# Altium schematic sheet KursSCH3.schdoc
size 420 x 297 mm; DocumentNumber: СПбПУ 12.03.2019 + Э3; SheetNumber: 3; SheetTotal: 4; Format: A3
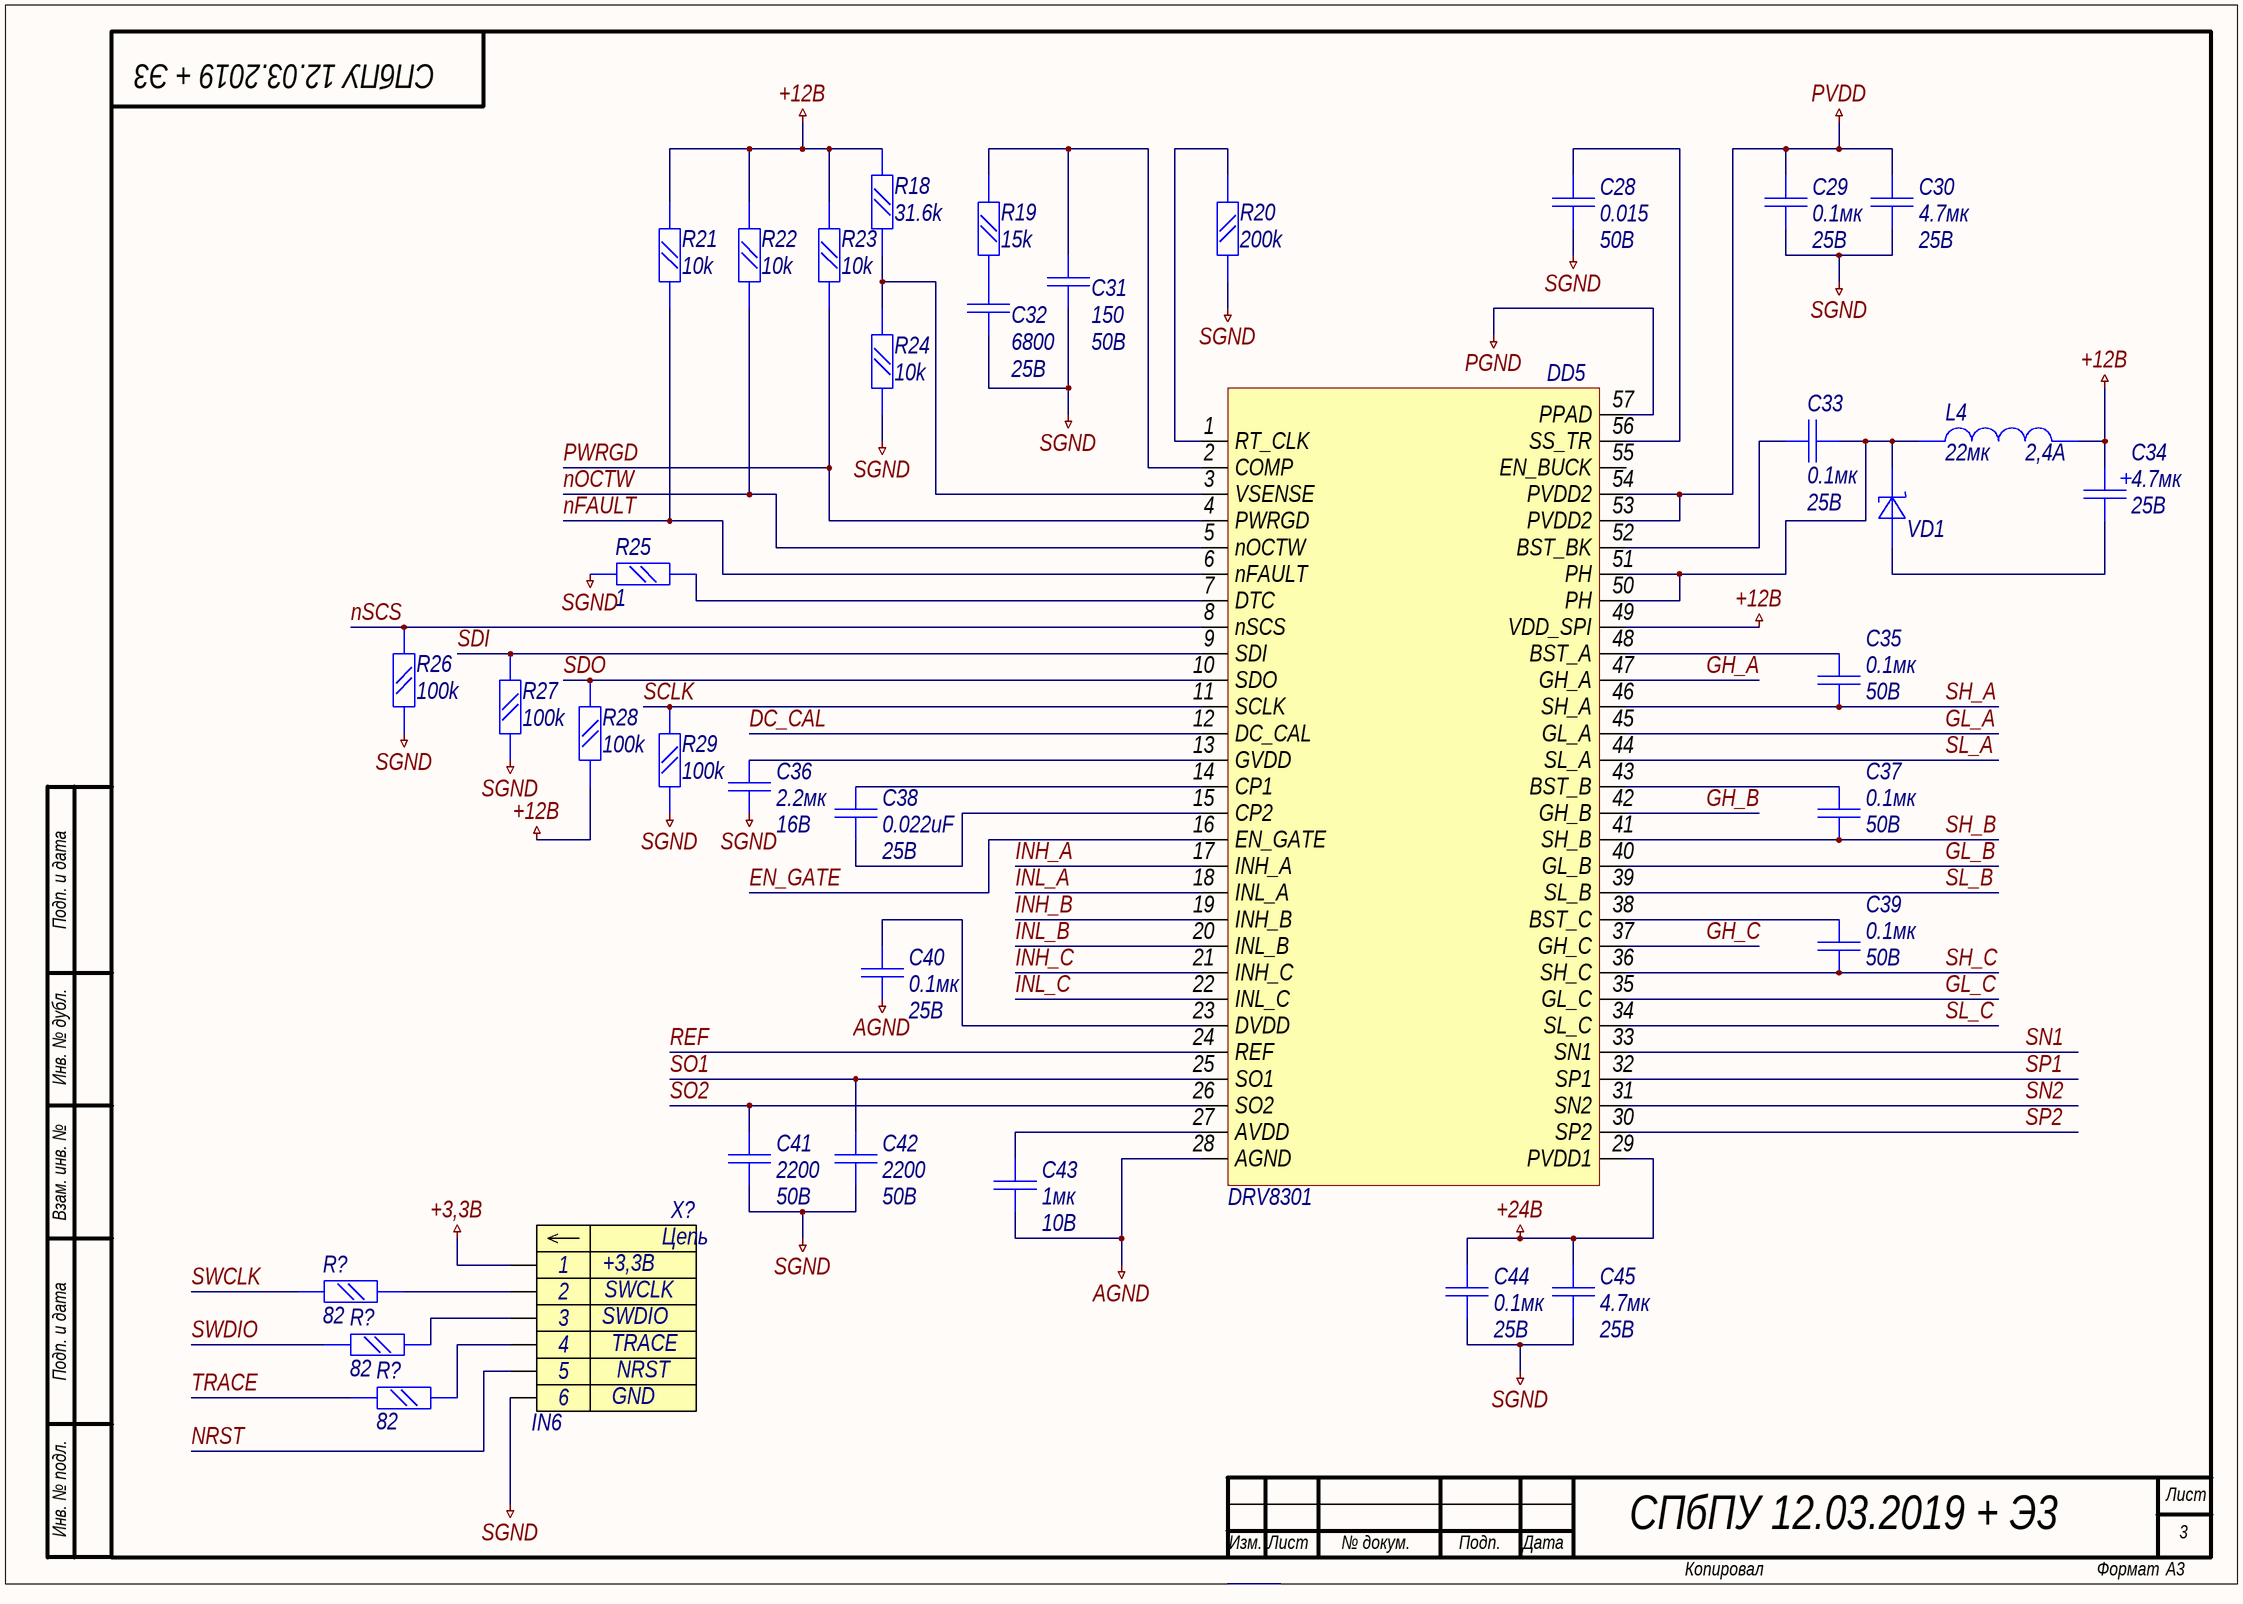
[diagram p0: KursSCH3.schdoc]

## Parts
(Parts that share a designator on the sheet are numbered #1, #2 ... from top to bottom, then left to right.)
C28  value 0.015  Voltage: 50В  [C0402]  (hidden comment: Capacitor)
C29  value 0.1мк  Voltage: 25В  [C0603]  (hidden comment: Capacitor)
C30  value 4.7мк  Voltage: 25В  [C0805]  (hidden comment: Capacitor)
C31  value 150  Voltage: 50В  [C0402]  (hidden comment: Capacitor)
C32  value 6800  Voltage: 25В  [C0402]  (hidden comment: Capacitor)
C33  value 0.1мк  Voltage: 25В  [C0603]  (hidden comment: Capacitor)
C34  value 4.7мк  Voltage: 25В  [C3528-p]  (hidden comment: Capacitor-T)
C35  value 0.1мк  Voltage: 50В  [C0805]  (hidden comment: Capacitor)
C36  value 2.2мк  Voltage: 16В  [C0603]  (hidden comment: Capacitor)
C37  value 0.1мк  Voltage: 50В  [C0805]  (hidden comment: Capacitor)
C38  value 0.022uF  Voltage: 25В  [C0603]  (hidden comment: Capacitor)
C39  value 0.1мк  Voltage: 50В  [C0805]  (hidden comment: Capacitor)
C40  value 0.1мк  Voltage: 25В  [C0603]  (hidden comment: Capacitor)
C41  value 2200  Voltage: 50В  [C0402]  (hidden comment: Capacitor)
C42  value 2200  Voltage: 50В  [C0402]  (hidden comment: Capacitor)
C43  value 1мк  Voltage: 10В  [C0603]  (hidden comment: Capacitor)
C44  value 0.1мк  Voltage: 25В  [C0603]  (hidden comment: Capacitor)
C45  value 4.7мк  Voltage: 25В  [C0805]  (hidden comment: Capacitor)
DD5  DRV8301
L4  I: 2,4А  L: 22мк  [747779115]  (hidden comment: 7447779115)
R18  value 31.6k  [R0603]  (hidden comment: Resistor_0,125W)
R19  value 15k  [R0603]  (hidden comment: Resistor_0,125W)
R20  value 200k  [R0603]  (hidden comment: Resistor_0,125W)
R21  value 10k  [R0402]  (hidden comment: Resistor_0,125W)
R22  value 10k  [R0402]  (hidden comment: Resistor_0,125W)
R23  value 10k  [R0402]  (hidden comment: Resistor_0,125W)
R24  value 10k  [R0402]  (hidden comment: Resistor_0,125W)
R25  value 1  [R0603]  (hidden comment: Resistor_0,125W)
R26  value 100k  [R0805]  (hidden comment: Resistor_0,125W)
R27  value 100k  [R0805]  (hidden comment: Resistor_0,125W)
R28  value 100k  [R0805]  (hidden comment: Resistor_0,125W)
R29  value 100k  [R0805]  (hidden comment: Resistor_0,125W)
R?#1  value 82  [R0603]  (hidden comment: Resistor_0,125W)
R?#2  value 82  [R0603]  (hidden comment: Resistor_0,125W)
R?#3  value 82  [R0603]  (hidden comment: Resistor_0,125W)
VD1  Schottky  [SOD-123]  (value not drawn)
X?  IN6  U: +3,3В  2: SWCLK  1: SWDIO  4: TRACE  3: NRST  [USB-B]

## Nets
+3,3В: X?.1
+12В: C34.1 DD5.49(VDD_SPI) L4.2 R18.2 R21.2 R22.2 R23.2 R28.1
+24В: C44.2 C45.2 DD5.29(PVDD1)
AGND: C40.1 C43.1 DD5.28(AGND)
PGND: DD5.57(PPAD)
PVDD: C29.2 C30.2 DD5.53(PVDD2) DD5.54(PVDD2)
SGND: C28.1 C29.1 C30.1 C31.1 C32.1 C36.1 C41.1 C42.1 C44.1 C45.1 R20.1 R24.1 R25.1 R26.1 R27.1 R29.1 X?.4(6)
DC_CAL: DD5.12(DC_CAL)
EN_GATE: DD5.16(EN_GATE)
GH_A: DD5.47(GH_A)
GH_B: DD5.42(GH_B)
GH_C: DD5.37(GH_C)
GL_A: DD5.45(GL_A)
GL_B: DD5.40(GL_B)
GL_C: DD5.35(GL_C)
INH_A: DD5.17(INH_A)
INH_B: DD5.19(INH_B)
INH_C: DD5.21(INH_C)
INL_A: DD5.18(INL_A)
INL_B: DD5.20(INL_B)
INL_C: DD5.22(INL_C)
nFAULT: DD5.6(nFAULT) R21.1
nOCTW: DD5.5(nOCTW) R22.1
NRST: X?.4(5)
nSCS: DD5.8(nSCS) R26.2
PWRGD: DD5.4(PWRGD) R23.1
REF: DD5.24(REF)
SCLK: DD5.11(SCLK) R29.2
SDI: DD5.9(SDI) R27.2
SDO: DD5.10(SDO) R28.2
SH_A: C35.1 DD5.46(SH_A)
SH_B: C37.1 DD5.41(SH_B)
SH_C: C39.1 DD5.36(SH_C)
SL_A: DD5.44(SL_A)
SL_B: DD5.39(SL_B)
SL_C: DD5.34(SL_C)
SN1: DD5.33(SN1)
SN2: DD5.31(SN2)
SO1: C42.2 DD5.25(SO1)
SO2: C41.2 DD5.26(SO2)
SP1: DD5.32(SP1)
SP2: DD5.30(SP2)
SWCLK: R?#1.1
SWDIO: R?#2.1
TRACE: R?#3.1
NetC28_2: C28.2 DD5.56(SS_TR)
NetC31_2: C31.2 DD5.2(COMP) R19.2
NetC32_2: C32.2 R19.1
NetC33_1: C33.1 DD5.50(PH) DD5.51(PH) L4.1 VD1.2(К)
NetC33_2: C33.2 DD5.52(BST_BK)
NetC34_2: C34.2 VD1.1(А)
NetC35_2: C35.2 DD5.48(BST_A)
NetC36_2: C36.2 DD5.13(GVDD)
NetC37_2: C37.2 DD5.43(BST_B)
NetC38_1: C38.1 DD5.15(CP2)
NetC38_2: C38.2 DD5.14(CP1)
NetC39_2: C39.2 DD5.38(BST_C)
NetC40_2: C40.2 DD5.23(DVDD)
NetC43_2: C43.2 DD5.27(AVDD)
NetDD5_1: DD5.1(RT_CLK) R20.2
NetDD5_3: DD5.3(VSENSE) R18.1 R24.2
NetDD5_7: DD5.7(DTC) R25.2
NetR?#1_2: R?#1.2 X?.2
NetR?#2_2: R?#2.2 X?.3
NetR?#3_2: R?#3.2 X?.4

Not connected (* = marked no-connect by the designer): DD5 55(EN_BUCK)

## Notes on the sheet
- Подп. и дата
- Инв. № дубл.
- Взам. инв. №
- Инв. № подл.
- Лист
- Изм.
- № докум.
- Подп.
- Дата
- Копировал
- Формат
- (in symbol USB-B_1) Цепь

## Library data of the parts
C28 = GRM155R71H153KA12D: Manufacturer: Murata; Type: Конденсатор; ID: 176; Tolerance: ±10%; Dielectric Type: X7R; Application Category: 1; Working Temperature Min: -55°С; Working Temperature Max: +125°С; Part Number: GRM155R71H153KA12D; Footprint: 0402
C29 C33 C40 C44 = GRM188R71E104KA01D: Manufacturer: Murata; Type: Конденсатор; ID: 228; Tolerance: ±10%; Dielectric Type: X7R; Application Category: 1; Working Temperature Min: -55°С; Working Temperature Max: +125°С; Part Number: GRM188R71E104KA01D; Footprint: 0603
C30 C45 = GRM21BR61E475KA12L: Manufacturer: Murata; Type: Конденсатор; ID: 233; Tolerance: ±10%; Dielectric Type: X5R; Application Category: 1; Working Temperature Min: -55°С; Working Temperature Max: +125°С; Part Number: GRM21BR61E475KA12L; Footprint: 0805
C31 = GRM1555C1H151JA01D: Manufacturer: Murata; Type: Конденсатор; ID: 187; Tolerance: ±5%; Dielectric Type: NP0; Application Category: 1; Working Temperature Min: -55°С; Working Temperature Max: +125°С; Part Number: GRM1555C1H151JA01D; Footprint: 0402
C32 = GRM155R71E682KA01D: Manufacturer: Murata; Type: Конденсатор; ID: 204; Tolerance: ±10%; Dielectric Type: X7R; Application Category: 1; Working Temperature Min: -55°С; Working Temperature Max: +125°С; Part Number: GRM155R71E682KA01D; Footprint: 0402
C34 = 293D475X9025B2TE3: Manufacturer: Vishay Intertechnology; Type: Конденсатор; ID: 5; Tolerance: ±10%; ESR: 2.8ohm; Part Number: 293D475X9025B2TE3; Footprint: B
C35 C37 C39 = GRM21BR71H104KA01L: Manufacturer: Murata; Type: Конденсатор; ID: 138; Tolerance: ±10%; Dielectric Type: X7R; Application Category: 1; Working Temperature Min: -55°С; Working Temperature Max: +125°С; Part Number: GRM21BR71H104KA01L; Footprint: 0805
C36 = GRM188R61C225KE15D: Manufacturer: Murata; Type: Конденсатор; ID: 152; Tolerance: ±10%; Dielectric Type: X5R; Application Category: 1; Working Temperature Min: -55°С; Working Temperature Max: +85°С; Part Number: GRM188R61C225KE15D; Footprint: 0603
C38 = GRM188R71E223KA01D: Manufacturer: Murata; Type: Конденсатор; ID: 128; Tolerance: ±10%; Dielectric Type: X7R; Application Category: 1; Working Temperature Min: -55°С; Working Temperature Max: +125°С; Part Number: GRM188R71E223KA01D; Footprint: 0603
C41 C42 = GRM155R71H222KA01D: Manufacturer: Murata; Type: Конденсатор; ID: 148; Tolerance: ±10%; Dielectric Type: X7R; Part Number: GRM155R71H222KA01D; Footprint: 0402
C43 = GRM188R61A105KA01D: Manufacturer: Murata; Type: Конденсатор; ID: 134; Tolerance: ±10%; Dielectric Type: X5R; Application Category: 1; Working Temperature Min: -55°С; Working Temperature Max: +85°С; Part Number: GRM188R61A105KA01D; Footprint: 0603
L4 = 7447779115: Name: CLF7045NIT-220M-D
R18 = RC0603FR-0731K6L: Manufacturer: Yageo; ID: 324; Limit Voltage: 50V; Tolerance: ±1%; Temperature Coefficient: 100ppm; Total Power Dissipation: 0.1W; Series Type: Thick-Film; Application Category: 1; Working Temperature Min: -55°С; Working Temperature Max: +155°С; Type: Резистор; Part Number: RC0603FR-0731K6L; Footprint: 0603
R19 = RC0603JR-0715KL: Manufacturer: Yageo; ID: 16; Limit Voltage: 50V; Tolerance: ±5%; Temperature Coefficient: 100ppm; Total Power Dissipation: 0.1W; Series Type: Thick-Film; Application Category: 1; Working Temperature Min: -55°С; Working Temperature Max: +155°С; Type: Резистор; Part Number: RC0603JR-0715KL; Footprint: 0603
R20 = RC0603JR-07200KL: Manufacturer: Yageo; ID: 27; Limit Voltage: 50V; Tolerance: ±5%; Temperature Coefficient: 100ppm; Total Power Dissipation: 0.1W; Series Type: Thick-Film; Application Category: 1; Working Temperature Min: -55°С; Working Temperature Max: +155°С; Type: Резистор; Part Number: RC0603JR-07200KL; Footprint: 0603
R21-R24 = RC0402FR-0710KL: Manufacturer: Yageo; ID: 2; Limit Voltage: 50V; Tolerance: ±1%; Temperature Coefficient: 100ppm; Total Power Dissipation: 0.1W; Series Type: Thick-Film; Application Category: 1; Working Temperature Min: -55°С; Working Temperature Max: +155°С; Type: Резистор; Part Number: RC0402FR-0710KL; Footprint: 0402
R25 = RC0603JR-071RL: Manufacturer: Yageo; ID: 6; Limit Voltage: 50V; Tolerance: ±5%; Temperature Coefficient: 100ppm; Total Power Dissipation: 0.1W; Series Type: Thick-Film; Working Temperature Min: -55°С; Working Temperature Max: +155°С; Type: Резистор; Part Number: RC0603JR-071RL; Footprint: 0603; Application Category: 1
R26-R29 = RC0805JR-07100KL: Manufacturer: Yageo; ID: 98; Limit Voltage: 150V; Tolerance: ±5%; Temperature Coefficient: 100ppm; Total Power Dissipation: 0.125W; Series Type: Thick-Film; Application Category: 1; Working Temperature Min: -55°С; Working Temperature Max: +155°С; Type: Резистор; Part Number: RC0805JR-07100KL; Footprint: 0805
R?#1-R?#3 = RC0603JR-0782RL: Manufacturer: Yageo; ID: 83; Limit Voltage: 50V; Tolerance: ±5%; Temperature Coefficient: 100ppm; Total Power Dissipation: 0.1W; Series Type: Thick-Film; Application Category: 1; Working Temperature Min: -55°С; Working Temperature Max: +155°С; Type: Резистор; Part Number: RC0603JR-0782RL; Footprint: 0603
VD1 = SD103BW: Type: Диод; ID: 2; Reverse Voltage: 30V; Reverse Current: 5uA; Forward Voltage: 0.37V; Forward Current: 350mA; Total Power Dissipation: 400mW; Capacitance: 28pF; Max Operating Frequency: 10nS; Application Category: 1; Part Number: SD103BW; Value: SD103BW
X? = USB-B_1: Create: DeathSpeaker; GND: GND